# EAGLE schematic esp32 (EAGLE 9.6.2)

## Sheet 1 of 3
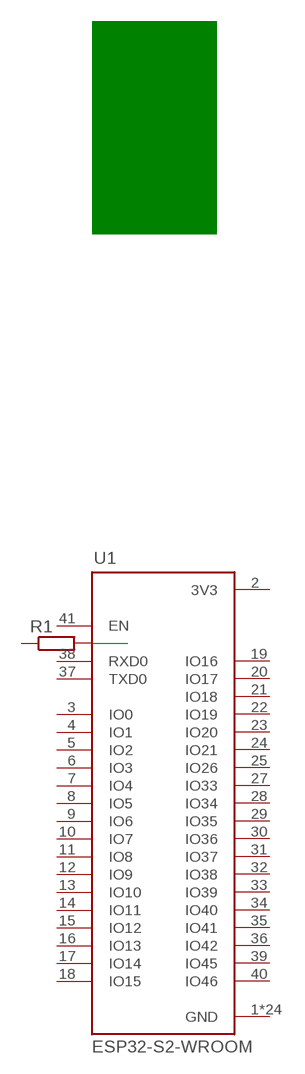
[diagram p0: schematic, sheet 1]

### Parts
R1  R-EU_R0603  [R0603]
U1  ESP32-S2-WROOM  [XCVR_ESP32-S2-WROOM]

### Nets
N$1: R1.2 U1.3(IO0)
Unconnected: R1.1 U1.4(IO1) U1.5(IO2) U1.6(IO3) U1.7(IO4) U1.8(IO5) U1.9(IO6) U1.10(IO7) U1.11(IO8) U1.12(IO9) U1.13(IO10) U1.14(IO11) U1.15(IO12) U1.16(IO13) U1.17(IO14) U1.18(IO15) U1.19(IO16) U1.20(IO17) U1.21(IO18) U1.22(IO19) U1.23(IO20) U1.24(IO21) U1.25(IO26) U1.27(IO33) U1.28(IO34) U1.29(IO35) U1.30(IO36) U1.31(IO37) U1.32(IO38) U1.33(IO39) U1.34(IO40) U1.35(IO41) U1.36(IO42) U1.37(TXD0) U1.38(RXD0) U1.39(IO45) U1.40(IO46) U1.41(EN)

## Sheet 2 of 3
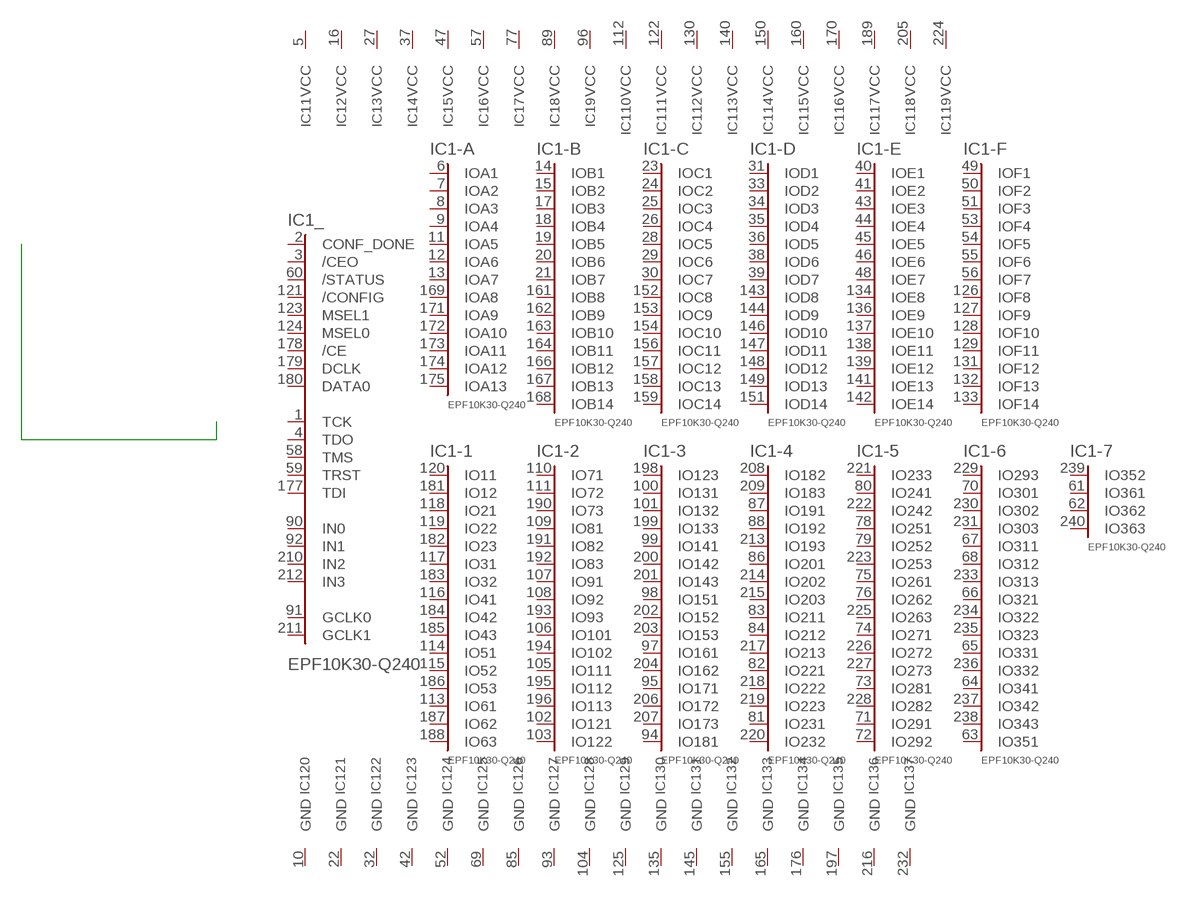
[diagram p1: schematic, sheet 2]

### Parts
IC1  EPF10K30-Q240  [PQFP240]
Unconnected: IC1.1(_:TCK) IC1.2(_:CONF_DONE) IC1.3(_:/CEO) IC1.4(_:TDO) IC1.6(-A:IOA1) IC1.7(-A:IOA2) IC1.8(-A:IOA3) IC1.9(-A:IOA4) IC1.11(-A:IOA5) IC1.12(-A:IOA6) IC1.13(-A:IOA7) IC1.14(-B:IOB1) IC1.15(-B:IOB2) IC1.17(-B:IOB3) IC1.18(-B:IOB4) IC1.19(-B:IOB5) IC1.20(-B:IOB6) IC1.21(-B:IOB7) IC1.23(-C:IOC1) IC1.24(-C:IOC2) IC1.25(-C:IOC3) IC1.26(-C:IOC4) IC1.28(-C:IOC5) IC1.29(-C:IOC6) IC1.30(-C:IOC7) IC1.31(-D:IOD1) IC1.33(-D:IOD2) IC1.34(-D:IOD3) IC1.35(-D:IOD4) IC1.36(-D:IOD5) IC1.38(-D:IOD6) IC1.39(-D:IOD7) IC1.40(-E:IOE1) IC1.41(-E:IOE2) IC1.43(-E:IOE3) IC1.44(-E:IOE4) IC1.45(-E:IOE5) IC1.46(-E:IOE6) IC1.48(-E:IOE7) IC1.49(-F:IOF1) IC1.50(-F:IOF2) IC1.51(-F:IOF3) IC1.53(-F:IOF4) IC1.54(-F:IOF5) IC1.55(-F:IOF6) IC1.56(-F:IOF7) IC1.58(_:TMS) IC1.59(_:TRST) IC1.60(_:/STATUS) IC1.61(-7:IO361) IC1.62(-7:IO362) IC1.63(-6:IO351) IC1.64(-6:IO341) IC1.65(-6:IO331) IC1.66(-6:IO321) IC1.67(-6:IO311) IC1.68(-6:IO312) IC1.70(-6:IO301) IC1.71(-5:IO291) IC1.72(-5:IO292) IC1.73(-5:IO281) IC1.74(-5:IO271) IC1.75(-5:IO261) IC1.76(-5:IO262) IC1.78(-5:IO251) IC1.79(-5:IO252) IC1.80(-5:IO241) IC1.81(-4:IO231) IC1.82(-4:IO221) IC1.83(-4:IO211) IC1.84(-4:IO212) IC1.86(-4:IO201) IC1.87(-4:IO191) IC1.88(-4:IO192) IC1.90(_:IN0) IC1.91(_:GCLK0) IC1.92(_:IN1) IC1.94(-3:IO181) IC1.95(-3:IO171) IC1.97(-3:IO161) IC1.98(-3:IO151) IC1.99(-3:IO141) IC1.100(-3:IO131) IC1.101(-3:IO132) IC1.102(-2:IO121) IC1.103(-2:IO122) IC1.105(-2:IO111) IC1.106(-2:IO101) IC1.107(-2:IO91) IC1.108(-2:IO92) IC1.109(-2:IO81) IC1.110(-2:IO71) IC1.111(-2:IO72) IC1.113(-1:IO61) IC1.114(-1:IO51) IC1.115(-1:IO52) IC1.116(-1:IO41) IC1.117(-1:IO31) IC1.118(-1:IO21) IC1.119(-1:IO22) IC1.120(-1:IO11) IC1.121(_:/CONFIG) IC1.123(_:MSEL1) IC1.124(_:MSEL0) IC1.126(-F:IOF8) IC1.127(-F:IOF9) IC1.128(-F:IOF10) IC1.129(-F:IOF11) IC1.131(-F:IOF12) IC1.132(-F:IOF13) IC1.133(-F:IOF14) IC1.134(-E:IOE8) IC1.136(-E:IOE9) IC1.137(-E:IOE10) IC1.138(-E:IOE11) IC1.139(-E:IOE12) IC1.141(-E:IOE13) IC1.142(-E:IOE14) IC1.143(-D:IOD8) IC1.144(-D:IOD9) IC1.146(-D:IOD10) IC1.147(-D:IOD11) IC1.148(-D:IOD12) IC1.149(-D:IOD13) IC1.151(-D:IOD14) IC1.152(-C:IOC8) IC1.153(-C:IOC9) IC1.154(-C:IOC10) IC1.156(-C:IOC11) IC1.157(-C:IOC12) IC1.158(-C:IOC13) IC1.159(-C:IOC14) IC1.161(-B:IOB8) IC1.162(-B:IOB9) IC1.163(-B:IOB10) IC1.164(-B:IOB11) IC1.166(-B:IOB12) IC1.167(-B:IOB13) IC1.168(-B:IOB14) IC1.169(-A:IOA8) IC1.171(-A:IOA9) IC1.172(-A:IOA10) IC1.173(-A:IOA11) IC1.174(-A:IOA12) IC1.175(-A:IOA13) IC1.177(_:TDI) IC1.178(_:/CE) IC1.179(_:DCLK) IC1.180(_:DATA0) IC1.181(-1:IO12) IC1.182(-1:IO23) IC1.183(-1:IO32) IC1.184(-1:IO42) IC1.185(-1:IO43) IC1.186(-1:IO53) IC1.187(-1:IO62) IC1.188(-1:IO63) IC1.190(-2:IO73) IC1.191(-2:IO82) IC1.192(-2:IO83) IC1.193(-2:IO93) IC1.194(-2:IO102) IC1.195(-2:IO112) IC1.196(-2:IO113) IC1.198(-3:IO123) IC1.199(-3:IO133) IC1.200(-3:IO142) IC1.201(-3:IO143) IC1.202(-3:IO152) IC1.203(-3:IO153) IC1.204(-3:IO162) IC1.206(-3:IO172) IC1.207(-3:IO173) IC1.208(-4:IO182) IC1.209(-4:IO183) IC1.210(_:IN2) IC1.211(_:GCLK1) IC1.212(_:IN3) IC1.213(-4:IO193) IC1.214(-4:IO202) IC1.215(-4:IO203) IC1.217(-4:IO213) IC1.218(-4:IO222) IC1.219(-4:IO223) IC1.220(-4:IO232) IC1.221(-5:IO233) IC1.222(-5:IO242) IC1.223(-5:IO253) IC1.225(-5:IO263) IC1.226(-5:IO272) IC1.227(-5:IO273) IC1.228(-5:IO282) IC1.229(-6:IO293) IC1.230(-6:IO302) IC1.231(-6:IO303) IC1.233(-6:IO313) IC1.234(-6:IO322) IC1.235(-6:IO323) IC1.236(-6:IO332) IC1.237(-6:IO342) IC1.238(-6:IO343) IC1.239(-7:IO352) IC1.240(-7:IO363)

## Sheet 3 of 3: USB-UART
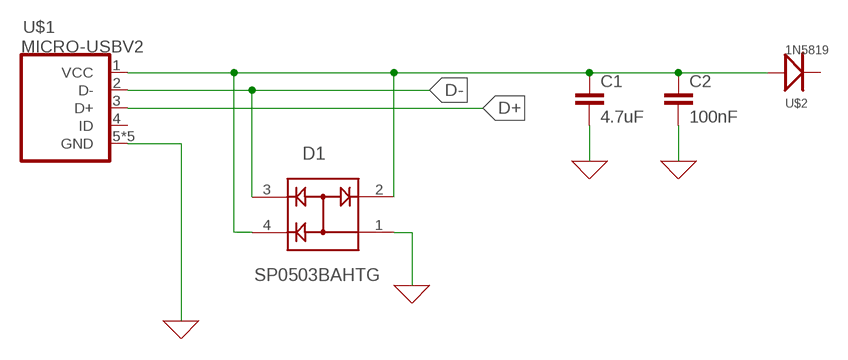
[diagram p2: schematic, sheet 3]

### Parts
C1  4.7uF  C-EUC0805  [C0805]
C2  100nF  C-EUC0805  [C0805]
D1  SP0503BAHTG  [SOT143]
U$1  MICRO-USBV2  [MICRO-USB-2]
U$2  1N5819  [SOD-123]

### Nets
0: C1.2 C2.2 U$1.5(GND) U$1.P$1(GND) U$1.P$2(GND) U$1.P$3(GND) U$1.P$4(GND) ; supply symbol labelled GND
D+: U$1.3(D+)
D-: D1.3 U$1.2(D-)
N$4: C1.1 C2.1 D1.2 D1.4 U$1.1(VCC) U$2.A
N$6: D1.1 ; supply symbol labelled GND
Unconnected: U$1.4(ID) U$2.K

## Power pins joined to a net without a drawn wire
3V3: U1.2(3V3)
GND: IC1.10(20:GND) IC1.22(21:GND) IC1.32(22:GND) IC1.42(23:GND) IC1.52(24:GND) IC1.69(25:GND) IC1.85(26:GND) IC1.93(27:GND) IC1.104(28:GND) IC1.125(29:GND) IC1.135(30:GND) IC1.145(31:GND) IC1.155(32:GND) IC1.165(33:GND) IC1.176(34:GND) IC1.197(35:GND) IC1.216(36:GND) IC1.232(37:GND) U1.1(GND) U1.26(GND) U1.42(GND) U1.43.1(GND) U1.43.2(GND) U1.43.3(GND) U1.43.4(GND) U1.43.5(GND) U1.43.6(GND) U1.43.7(GND) U1.43.8(GND) U1.43.9(GND) U1.43.10(GND) U1.43.11(GND) U1.43.12(GND) U1.43.13(GND) U1.43.14(GND) U1.43.15(GND) U1.43.16(GND) U1.43.17(GND) U1.43.18(GND) U1.43.19(GND) U1.43.20(GND) U1.43.21(GND)
VCC: IC1.5(1:VCC) IC1.16(2:VCC) IC1.27(3:VCC) IC1.37(4:VCC) IC1.47(5:VCC) IC1.57(6:VCC) IC1.77(7:VCC) IC1.89(8:VCC) IC1.96(9:VCC) IC1.112(10:VCC) IC1.122(11:VCC) IC1.130(12:VCC) IC1.140(13:VCC) IC1.150(14:VCC) IC1.160(15:VCC) IC1.170(16:VCC) IC1.189(17:VCC) IC1.205(18:VCC) IC1.224(19:VCC)

## Library data of the parts
C1 C2 = rcl:C-EU: CAPACITOR, European symbol; SPICEPREFIX: C
D1 = SP0503BAHTG:SP0503BAHTG: TVS DIODE 5.5VWM 8.5VC SOT143 Check availability <https://pricing.snapeda.com/parts/SP0503BAHTG/Littelfuse%20Inc./view-part?ref=eda>; AVAILABILITY: In Stock; DESCRIPTION: 8.5V Clamp - Ipp Tvs Diode Surface Mount SOT-143-4; MF: Littelfuse Inc.; MP: SP0503BAHTG; PACKAGE: None; PRICE: None; PURCHASE-URL: https://pricing.snapeda.com/search/part/SP0503BAHTG/?ref=eda
IC1 = altera:EPF10K30-Q240: EPF10K30 FLEX 10K family; MPN: EPF10K30AQC240-3N; OC_FARNELL: 1549384; OC_NEWARK: 51R8956
R1 = rcl:R-EU_: RESISTOR, European symbol; SPICEPREFIX: R
U1 = ESP32-S2-WROOM:ESP32-S2-WROOM: WiFi 802.11b/g/n Transceiver Module 2.4GHz PCB Trace Surface Mount Check availability <https://pricing.snapeda.com/parts/ESP32-S2-WROOM/Espressif%20Systems/view-part?ref=eda>; AVAILABILITY: In Stock; DESCRIPTION: WiFi 802.11b/g/n Transceiver Module 2.4GHz Antenna Not Included, I-PEX Surface Mount; MF: Espressif Systems; MP: ESP32-S2-WROOM; PACKAGE: VFQFN-56 Espressif Systems; PRICE: None; PURCHASE-URL: https://pricing.snapeda.com/search/part/ESP32-S2-WROOM/?ref=eda
U$1 = microusb:MICRO-USB: Micro USB B connector
U$2 = 1N5819:1N5819: Check availability <https://pricing.snapeda.com/parts/1N5819/STMicroelectronics/view-part?ref=eda>; AVAILABILITY: In Stock; DESCRIPTION: DIODE, SCHOTTKY, 1A, 40V; Diode Type:Schottky; Voltage, Vrrm:40V; Current, If AV:1A; Current, Ifsm:25A; Voltage, Vf Max:0.9V; Temperature, Tj Max:125°C; Termination Type:Axial Leaded; Case Style:DO-41; No. of Pins:2; Current, If ;RoHS Compliant: Yes; MF: STMicroelectronics; MP: 1N5819; PACKAGE: DO-41 Multicomp; PRICE: None; PURCHASE-URL: https://pricing.snapeda.com/search/part/1N5819/?ref=eda